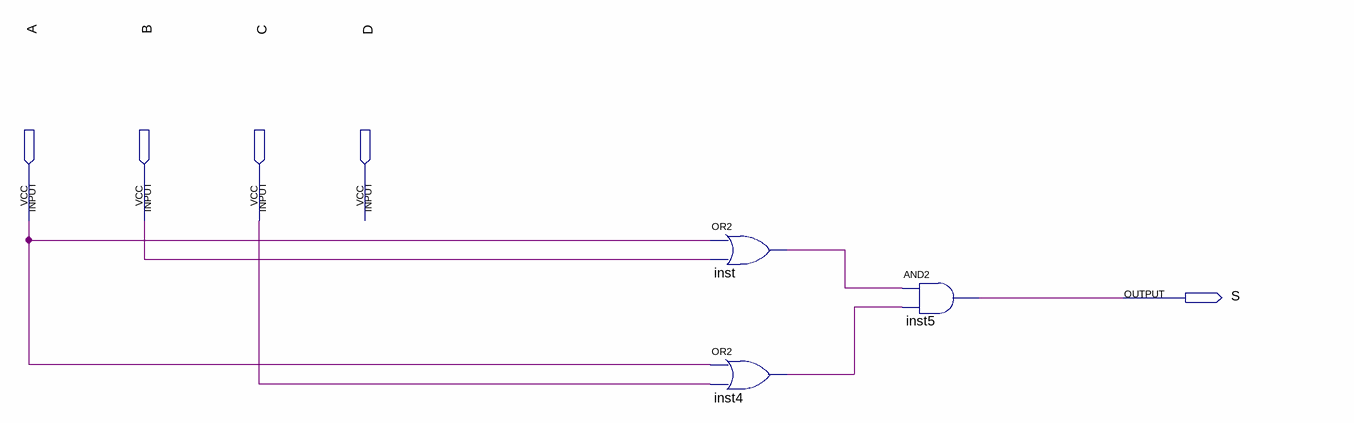
[diagram p0: schematic sheet]
// Quartus schematic Lab2_part2.bdf as structural Verilog: 3 symbols, 5 pins
module Lab2_part2 (
  input  A,
  input  B,
  input  C,
  input  D,
  output S
);

  wire inst4_out, inst_out;

  or inst (inst_out, A, B);
  or inst4 (inst4_out, A, C);
  and inst5 (S, inst_out, inst4_out);
endmodule
